# EAGLE schematic EXP (EAGLE 5.11)
BOM: EXCLUDE; PARTNO: CC0402ZRY5V7BB104
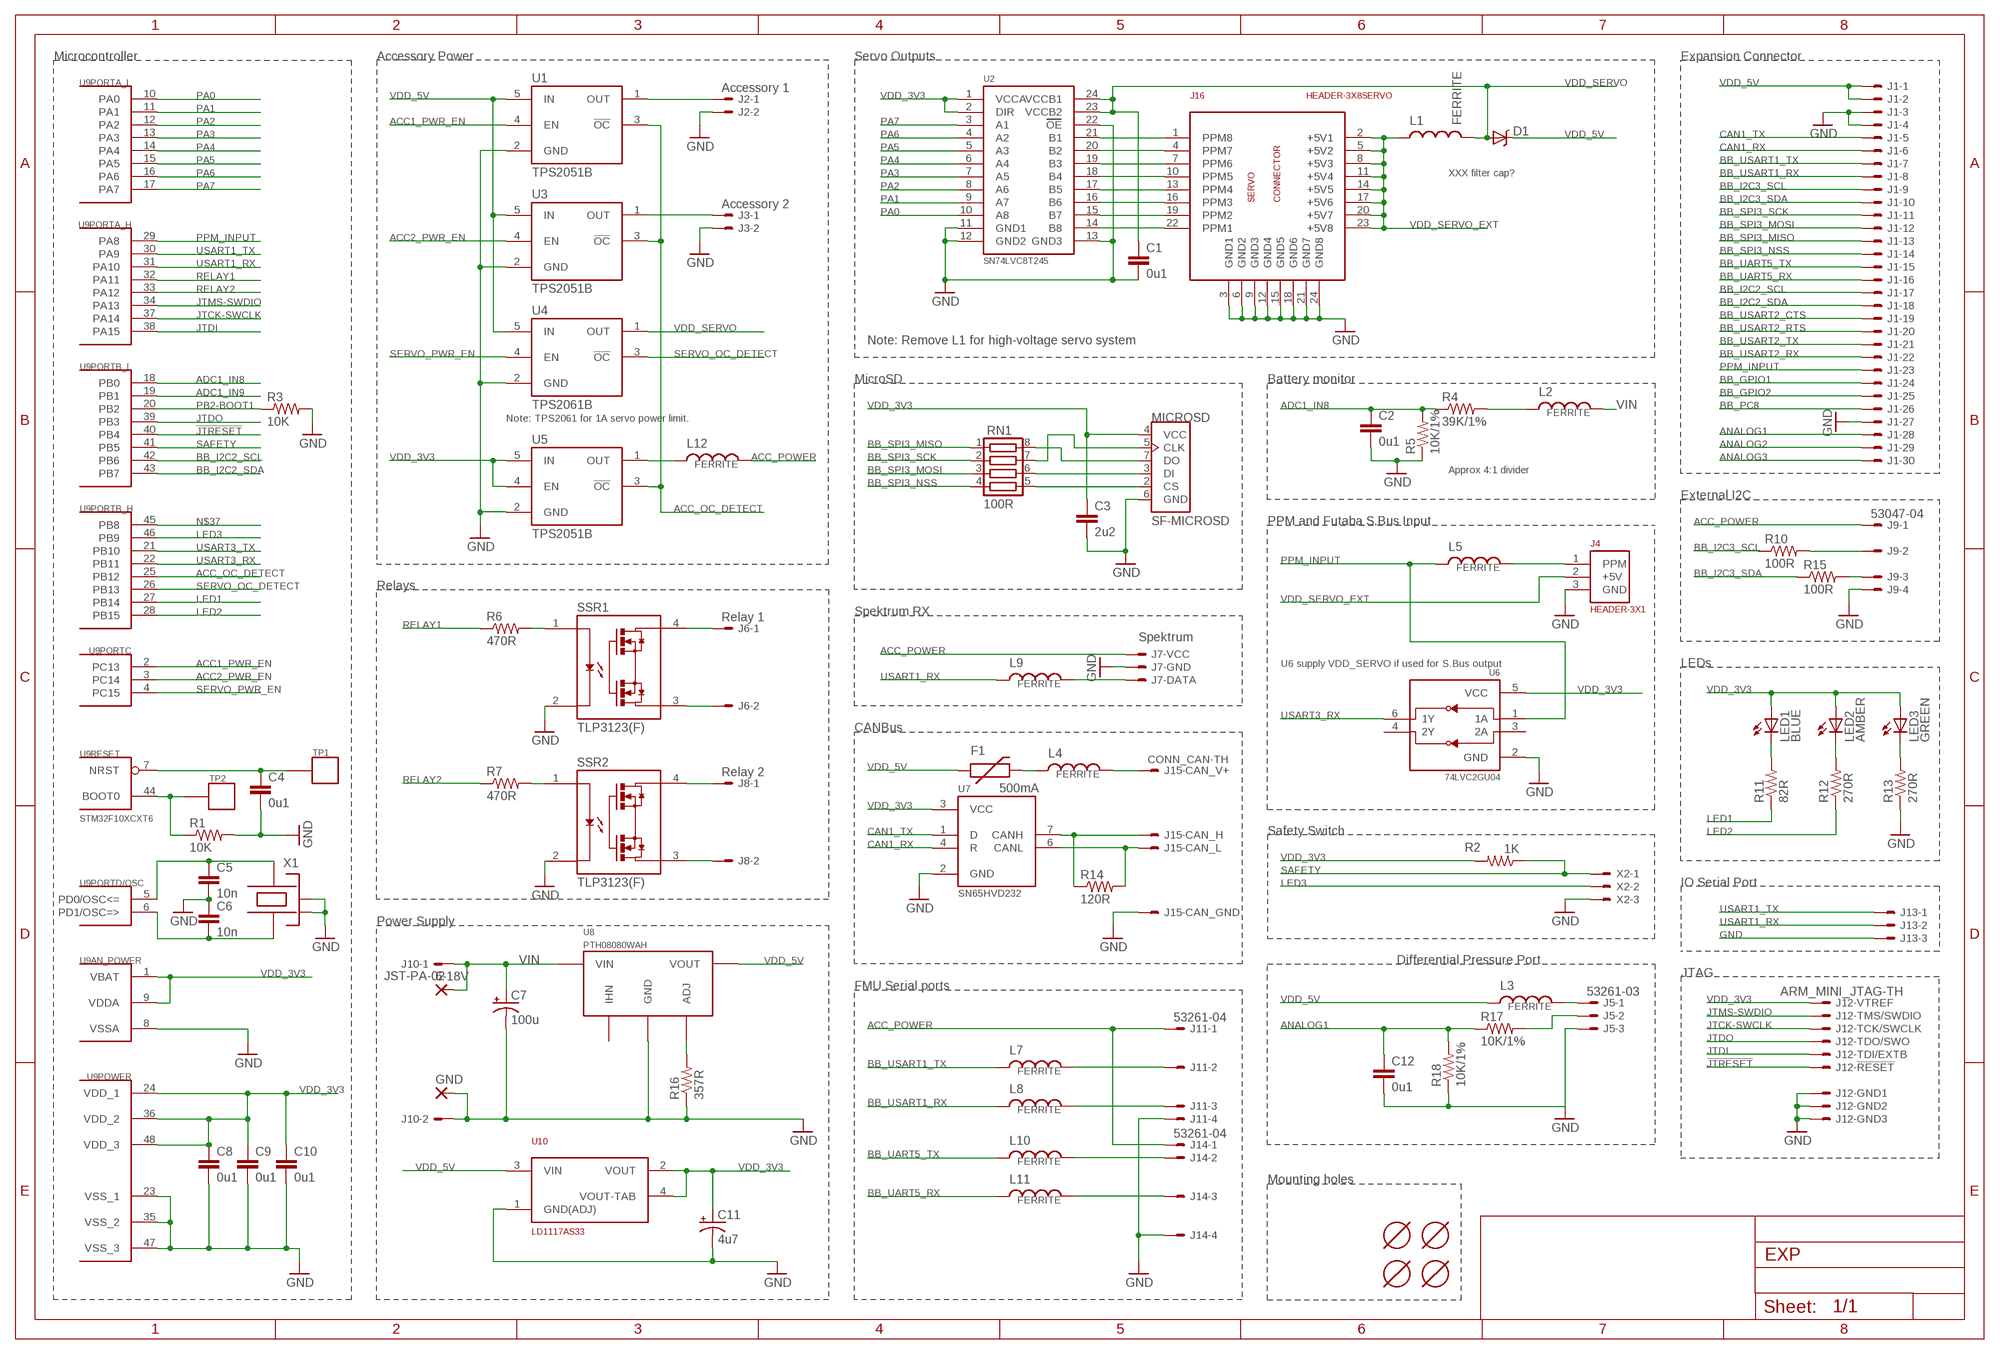
[diagram p0: schematic, sheet 1]

## Parts
6-18V  WIREPADSMD3,5-2  [3,5-2]
C1  0u1  CAP0402-CAP  [0402-CAP]
C2  0u1  CAP0402-CAP  [0402-CAP]
C3  2u2  CAP0402-CAP  [0402-CAP]
C4  0u1  CAP0402-CAP  [0402-CAP]
C5  10n  CAP0402-CAP  [0402-CAP]
C6  10n  CAP0402-CAP  [0402-CAP]
C7  100u  CAP_POL7343  [EIA7343]
C8  0u1  CAP0402-CAP  [0402-CAP]
C9  0u1  CAP0402-CAP  [0402-CAP]
C10  0u1  CAP0402-CAP  [0402-CAP]
C11  4u7  CAP_POL1206  [EIA3216]
C12  0u1  CAP0402-CAP  [0402-CAP]
D1  DIODE-SCHOTTKY_MSMP  [MICROSMP]
F1  500mA  PTC0603  [0603]
GND  WIREPADSMD3,5-2  [3,5-2]
J1  HEADER_2X15-REV  [HEADER_2MM_2X15_REVERSE]
J2  Accessory 1  53047-02  [53047-02]
J3  Accessory 2  53047-02  [53047-02]
J4  HEADER-3X1  [3X1RA]
J5  53261-03  [53261-03]
J6  Relay 1  53047-02  [53047-02]
J7  CONN_SPEKTRUM_RX-TH  [B3B-ZR]
J8  Relay 2  53047-02  [53047-02]
J9  53047-04  [53047-04]
J10  JST-PA-02  [S02B-PASK-2]
J11  53261-04  [53261-04]
J12  ARM_MINI_JTAG-TH  [FTSH-105-01-XXX-DV]
J13  53047-03  [53047-03]
J14  53261-04  [53261-04]
J15  CONN_CAN-TH  [B4B-PH-K-S]
J16  HEADER-3X8SERVO  [3X8RA]
L1  FERRITE  INDUCTOR0402  [0402-IND]
L2  FERRITE  INDUCTOR0402  [0402-IND]
L3  FERRITE  INDUCTOR0402  [0402-IND]
L4  FERRITE  INDUCTOR0402  [0402-IND]
L5  FERRITE  INDUCTOR0402  [0402-IND]
L7  FERRITE  INDUCTOR0402  [0402-IND]
L8  FERRITE  INDUCTOR0402  [0402-IND]
L9  FERRITE  INDUCTOR0402  [0402-IND]
L10  FERRITE  INDUCTOR0402  [0402-IND]
L11  FERRITE  INDUCTOR0402  [0402-IND]
L12  FERRITE  INDUCTOR0402  [0402-IND]
LED1  BLUE  LED0603  [LED-0603]
LED2  AMBER  LED0603  [LED-0603]
LED3  GREEN  LED0603  [LED-0603]
MICROSD  SF-MICROSD  [MICROSD]
R1  10K  RESISTOR0402-RES  [0402-RES]
R2  1K  RESISTOR0402-RES  [0402-RES]
R3  10K  RESISTOR0402-RES  [0402-RES]
R4  39K/1%  RESISTOR0402-RES  [0402-RES]
R5  10K/1%  RESISTOR0402-RES  [0402-RES]
R6  470R  RESISTOR0402-RES  [0402-RES]
R7  470R  RESISTOR0402-RES  [0402-RES]
R10  100R  RESISTOR0402-RES  [0402-RES]
R11  82R  RESISTOR0402-RES  [0402-RES]
R12  270R  RESISTOR0402-RES  [0402-RES]
R13  270R  RESISTOR0402-RES  [0402-RES]
R14  120R  RESISTOR0402-RES  [0402-RES]
R15  100R  RESISTOR0402-RES  [0402-RES]
R16  357R  RESISTOR0402-RES  [0402-RES]
R17  10K/1%  RESISTOR0402-RES  [0402-RES]
R18  10K/1%  RESISTOR0402-RES  [0402-RES]
RN1  100R  CTS742C083  [CTS742C083]
SSR1  TLP3123(F)  TLP3123SO  [SOP4-2.54]
SSR2  TLP3123(F)  TLP3123SO  [SOP4-2.54]
TP1  PAD.03  [PAD.03X.03]
TP2  PAD.03  [PAD.03X.03]
U1  TPS2051B  [SOT23-5L]
U2  SN74LVC8T245  [R-PDSO-G24]
U3  TPS2051B  [SOT23-5L]
U4  TPS2061B  TPS2051B  [SOT23-5L]
U5  TPS2051B  [SOT23-5L]
U6  74LVC2GU04  [SOT363_PHILIPS]
U7  SN65HVD232  [SO08]
U8  PTH08080WAH  [PTH08080W_TH]
U9  STM32F10XCXT6  [TQFP48]
U10  LD1117AS33  [SOT-223]
U$2  MOUNT-HOLE2.1MM  [MOUNT-HOLE2.1]
U$3  MOUNT-HOLE2.1MM  [MOUNT-HOLE2.1]
U$4  MOUNT-HOLE2.1MM  [MOUNT-HOLE2.1]
U$5  MOUNT-HOLE2.1MM  [MOUNT-HOLE2.1]
X1  OSCILLATOR  [OSCILLATOR-5.0X3.2]
X2  53261-03  [53261-03]

## Nets
!JTRESET: J12.10 U9.40(PORTB_L:PB4)
ACC1_PWR_EN: U1.4(EN) U9.2(PORTC:PC13)
ACC2_PWR_EN: U3.4(EN) U9.3(PORTC:PC14)
ACC_OC_DETECT: U1.3(!OC) U3.3(!OC) U5.3(!OC) U9.25(PORTB_H:PB12)
ACC_POWER [power]: J7.3 J9.1 J11.1 J14.1 L12.2
ADC1_IN8: C2.1 R4.1 R5.2 U9.18(PORTB_L:PB0)
ADC1_IN9: U9.19(PORTB_L:PB1)
ANALOG1: C12.1 J1.28 R17.1 R18.2
ANALOG2: J1.29
ANALOG3: J1.30
BB_GPIO1: J1.24
BB_GPIO2: J1.25
BB_I2C2_SCL: J1.17 U9.42(PORTB_L:PB6)
BB_I2C2_SDA: J1.18 U9.43(PORTB_L:PB7)
BB_I2C3_SCL: J1.9 R10.1
BB_I2C3_SDA: J1.10 R15.1
BB_PC8: J1.26
BB_SPI3_MISO: J1.13 RN1.1
BB_SPI3_MOSI: J1.12 RN1.3
BB_SPI3_NSS: J1.14 RN1.4
BB_SPI3_SCK: J1.11 RN1.2
BB_UART5_RX: J1.16 L11.1
BB_UART5_TX: J1.15 L10.1
BB_USART1_RX: J1.8 L8.1
BB_USART1_TX: J1.7 L7.1
BB_USART2_CTS: J1.19
BB_USART2_RTS: J1.20
BB_USART2_RX: J1.22
BB_USART2_TX: J1.21
BOOT0: R1.1 TP2.P$1 U9.44(RESET:BOOT0)
CAN1_RX: J1.6 U7.4(R)
CAN1_TX: J1.5 U7.1(D)
GND [power]: C1.2 C2.2 C3.2 C4.2 C5.2 C6.1 C7.C(-) C8.2 C9.2 C10.2 C11.C(-) C12.2 GND.1(P) J1.3 J1.4 J1.27 J2.2 J3.2 J4.3(GND) J5.3 J7.2 J9.4 J10.2 J11.4 J12.3 J12.5 J12.9 J13.3 J14.4 J15.4 J16.3(GND1) J16.6(GND2) J16.9(GND3) J16.12(GND4) J16.15(GND5) J16.18(GND6) J16.21(GND7) J16.24(GND8) MICROSD.6(GND) R1.2 R3.2 R5.1 R13.1 R16.1 R18.1 SSR1.2 SSR2.2 U1.2(GND) U2.11(GND1) U2.12(GND2) U2.13(GND3) U2.22(OE) U3.2(GND) U4.2(GND) U5.2(GND) U6.2(GND) U7.2(GND) U8.2(GND) U9.8(AN_POWER:VSSA) U9.23(POWER:VSS_1) U9.35(POWER:VSS_2) U9.47(POWER:VSS_3) U10.1(GND(ADJ)) X1.2(NC_2) X1.4(NC_4) X2.3
J6-DATA: J7.1 L9.2
JTCK-SWCLK: J12.4 U9.37(PORTA_H:PA14)
JTDI: J12.8 U9.38(PORTA_H:PA15)
JTDO: J12.6 U9.39(PORTB_L:PB3)
JTMS-SWDIO: J12.2 U9.34(PORTA_H:PA13)
LED1: R11.1 U9.27(PORTB_H:PB14)
LED2: R12.1 U9.28(PORTB_H:PB15)
LED3: U9.46(PORTB_H:PB9) X2.2
N$1: R7.2 SSR2.1
N$2: R6.2 SSR1.1
N$3: MICROSD.7(DO) RN1.8
N$4 [power]: L12.1 U5.1(OUT)
N$5: C6.2 U9.6(PORTD/OSC:PD1/OSC=>) X1.1
N$6: C5.1 U9.5(PORTD/OSC:PD0/OSC<=) X1.3
N$7: L2.1 R4.2
N$8: LED1.C R11.2
N$9: R16.2 U8.4(ADJ)
N$10: J4.1(PPM) L5.2
N$11: MICROSD.5(CLK) RN1.7
N$12: MICROSD.3(DI) RN1.6
N$13: MICROSD.2(CS) RN1.5
N$14: F1.2 L4.1
N$15: J5.2 R17.2
N$19: J14.3 L11.2
N$21 [power]: J8.1 SSR2.4
N$22 [power]: J8.2 SSR2.3
N$23 [power]: J6.2 SSR1.3
N$24 [power]: J6.1 SSR1.4
N$25: J14.2 L10.2
N$26: J11.3 L8.2
N$27: J9.3 R15.2
N$28: J9.2 R10.2
N$29 [power]: J2.1 U1.1(OUT)
N$30 [power]: J3.1 U3.1(OUT)
N$31: LED2.C R12.2
N$37: U9.45(PORTB_H:PB8)
N$38: LED3.C R13.2
N$41: J11.2 L7.2
N$43: J15.2 R14.1 U7.7(CANH)
N$44: J15.3 R14.2 U7.6(CANL)
N$47 [power]: J15.1 L4.2
NRST: C4.1 TP1.P$1 U9.7(RESET:NRST)
PA0: U2.10(A8) U9.10(PORTA_L:PA0)
PA1: U2.9(A7) U9.11(PORTA_L:PA1)
PA2: U2.8(A6) U9.12(PORTA_L:PA2)
PA3: U2.7(A5) U9.13(PORTA_L:PA3)
PA4: U2.6(A4) U9.14(PORTA_L:PA4)
PA5: U2.5(A3) U9.15(PORTA_L:PA5)
PA6: U2.4(A2) U9.16(PORTA_L:PA6)
PA7: U2.3(A1) U9.17(PORTA_L:PA7)
PB2-BOOT1: R3.1 U9.20(PORTB_L:PB2)
PPM1: J16.22(PPM1) U2.14(B8)
PPM2: J16.19(PPM2) U2.15(B7)
PPM3: J16.16(PPM3) U2.16(B6)
PPM4: J16.13(PPM4) U2.17(B5)
PPM5: J16.10(PPM5) U2.18(B4)
PPM6: J16.7(PPM6) U2.19(B3)
PPM7: J16.4(PPM7) U2.20(B2)
PPM8: J16.1(PPM8) U2.21(B1)
PPM_INPUT: J1.23 L5.1 U6.1(1A) U9.29(PORTA_H:PA8)
RELAY1: R6.1 U9.32(PORTA_H:PA11)
RELAY2: R7.1 U9.33(PORTA_H:PA12)
SAFETY: R2.1 U9.41(PORTB_L:PB5) X2.1
SERVO_OC_DETECT: U4.3(!OC) U9.26(PORTB_H:PB13)
SERVO_PWR_EN: U4.4(EN) U9.4(PORTC:PC15)
USART1_RX: J13.2 L9.1 U9.31(PORTA_H:PA10)
USART1_TX: J13.1 U9.30(PORTA_H:PA9)
USART3_RX: U6.6(1Y) U9.22(PORTB_H:PB11)
USART3_TX: U9.21(PORTB_H:PB10)
VDD_3V3 [power]: C3.1 C8.1 C9.1 C10.1 C11.A(+) J12.1 LED1.A LED2.A LED3.A MICROSD.4(VCC) R2.2 U2.1(VCCA) U2.2(DIR) U5.4(EN) U5.5(IN) U6.5(VCC) U7.3(VCC) U9.1(AN_POWER:VBAT) U9.9(AN_POWER:VDDA) U9.24(POWER:VDD_1) U9.36(POWER:VDD_2) U9.48(POWER:VDD_3) U10.2(VOUT) U10.4(VOUT-TAB)
VDD_5V [power]: D1.CATHODE(C) F1.1 J1.1 J1.2 L3.1 U1.5(IN) U3.5(IN) U4.5(IN) U8.3(VOUT) U10.3(VIN)
VDD_5V_ANALOG [power]: J5.1 L3.2
VDD_SERVO [power]: C1.1 D1.ANODE(A) L1.2 U2.23(VCCB2) U2.24(VCCB1) U4.1(OUT)
VDD_SERVO_EXT [power]: J4.2(+5V) J16.2(+5V1) J16.5(+5V2) J16.8(+5V3) J16.11(+5V4) J16.14(+5V5) J16.17(+5V6) J16.20(+5V7) J16.23(+5V8) L1.1
VIN [power]: 6-18V.1(P) C7.A(+) J10.1 L2.2 U8.1(VIN)
Unconnected: U6.3(2A) U6.4(2Y) U7.5(NC) U7.8(NC2) U8.5(IHN)

## Notes on the sheet
- Microcontroller | Accessory Power | Servo Outputs | Expansion Connector
- XXX filter cap?
- Note: Remove L1 for high-voltage servo system
- MicroSD | Battery monitor
- Note: TPS2061 for 1A servo power limit.
- Approx 4:1 divider
- External I2C
- PPM and Futaba S.Bus Input
- Relays
- Spektrum RX
- Spektrum
- U6 supply VDD_SERVO if used for S.Bus output | LEDs
- CANBus
- Safety Switch
- IO Serial Port
- Power Supply
- Differential Pressure Port
- JTAG
- FMU Serial ports
- Mounting holes

## Library data of the parts
6-18V GND = pixhawk2:WIREPAD: Wire PAD connect wire on PCB
C1-C6 C8-C10 C12 = pixhawk2:CAP: Capacitor Standard 0603 ceramic capacitor, and 0.1" leaded capacitor.
C7 C11 = pixhawk2:CAP_POL: Capacitor Polarized These are standard SMD and PTH capacitors. Normally 10uF, 47uF, and 100uF in electrolytic and tantalum varieties. Always verify the external diameter of the through hole cap, it varies with capacity, voltage, and manufacturer. The EIA devices should be standard.
D1 = pixhawk2:DIODE-SCHOTTKY: Schottky barrier diode in DO214AC, e.g. Fairchild SS14.
F1 = pixhawk2:PTC: Resettable Fuse PTC Resettable Fuse. Spark Fun Electronics SKU : COM-08357
J1 = pixhawk2:HEADER_2X15: 2X15 header
J2 J3 J6 J8 = pixhawk2:53?-02: CONNECTOR wire to board 1.25 mm (.049 inch) pitch header
J4 = pixhawk2:HEADER-3X1
J5 J13 X2 = pixhawk2:53?-03: CONNECTOR wire to board 1.25 mm (.049 inch) pitch header
J7 = pixhawk2:CONN_SPEKTRUM_RX: Spektrum RX connector; JST ZH series S3B-ZR-SM4A-TF
J9 J11 J14 = pixhawk2:53?-04: CONNECTOR wire to board 1.25 mm (.049 inch) pitch header
J10 = pixhawk2:JST-PA-02: JST PA Series http://www.jst-mfg.com/product/pdf/eng/ePA-F.pdf
J12 = pixhawk2:ARM_MINI_JTAG: CONNECTOR wire to board 1.25 mm (.049 inch) pitch header
J15 = pixhawk2:CONN_CAN
J16 = pixhawk2:HEADER-3X8
L1-L5 L7-L12 = pixhawk2:INDUCTOR: Inductors Basic Inductor/Choke - 0603 and 1206. Footprints are not proven and vary greatly between part numbers.
LED1-LED3 = pixhawk2:LED: LEDs Standard schematic elements and footprints for 5mm, 3mm, 1206, and 0603 sized LEDs. 5mm - Spark Fun Electronics SKU : COM-00529 (and others)
MICROSD = pixhawk2:SF-MICROSD
R1-R7 R10-R18 = pixhawk2:RESISTOR: Resistor Basic schematic elements and footprints for 0603, 1206, and PTH 1/10th watt (small) resistors.
RN1 = pixhawk2:CTS742C083: Chip Resistor Array 4 Single Resistor Source: http://www.ctscorp.com/components/Datasheets/CTSChipArrayDs.pdf; OC_FARNELL: unknown; OC_NEWARK: unknown
SSR1 SSR2 = pixhawk2:TLP3123: TLP3123 Solid State Relay The TOSHIBA TLP3123 consists of a gallium arsenide infrared emitting diode optically coupled to a photo-MOS FET in a plastic SOP package. The TLP3123 is a bi-directional switch, which can replace mechanical relays in many applications. And its high on-state current maximum rating and low on-state resistance is suitable to control a power line. http://www.semicon.toshiba.co.jp/docs/datasheet/en/Opto/TLP3123_en_datasheet_071001.pdf
TP1 TP2 = pixhawk2:PAD
U1 U3-U5 = pixhawk2:TPS2051B: CURRENT-LIMITED, POWER-DISTRIBUTION SWITCH The TPS204xB/TPS205xB power-distribution switches are intended for applications where heavy capacitive loads and short circuits are likely to be encountered. 500-mA continuous current, accurate Current Limit (0.75 A min, 1.25 A max), operating range: 2.7 V to 5.5 V. These devices incorporates 70-m? N-channel MOSFET power switches for power-distribution systems that require multiple power switches in a single package. Each switch is controlled by a logic enable input. Gate drive is provided by an internal charge pump designed to control the power-switch rise times and fall times to minimize current surges during switching. The charge pump requires no external components and allows operation from supplies as low as 2.7 V. http://focus.ti.com/lit/ds/symlink/tps2051b.pdf
U2 = pixhawk2:SN74LVC8T245
U6 = pixhawk2:74LVC2GU04: DUAL INVERTER GATE This dual inverter is designed for 1.65-V to 5.5-V VCC operation. The SN74LVC2GU04 contains two inverters with unbuffered outputs and performs the Boolean function Y = A. It is available from NXP and TI. http://www.nxp.com/documents/data_sheet/74LVC2GU04.pdf http://focus.ti.com/lit/ds/symlink/sn74lvc2gu04.pdf
U7 = pixhawk2:SN65HVD232: 3.3-V CAN TRANSCEIVER
U8 = pixhawk2:PTH08080W: 2.25-A, WIDE-INPUT ADJUSTABLE SWITCHING REGULATOR The input voltage range of the PTH08080W is from 4.5 V to 18 V, allowing operation from either a 5-V or 12-V input bus. Using state-of-the-art switched-mode power-conversion technology, the PTH08080W can step down to voltages as low as 0.9 V from a 5-V input bus, with less than 1 W of power dissipation. The output voltage can be adjusted to any voltage over the range, 0.9 V to 5.5 V, using a single external resistor. Operating features include an undervoltage lockout (UVLO), on/off inhibit, overcurrent protection, and overtemperature protection. http://focus.ti.com/lit/ds/symlink/pth08080w.pdf
U9 = pixhawk2:STM32F10XCXT6: ST STM32F101/103 48pin LQFP
U10 = pixhawk2:LD1117A: LD1117A LDO Datasheet: http://www.st.com/stonline/books/pdf/docs/7194.pdf
U$2-U$5 = pixhawk2:MOUNT-HOLE
X1 = pixhawk2:OSCILLATOR: Crystal Oscillator in 3.2x2.5 SMD

## Net classes
0 default: width 0.203 mm, clearance 0.203 mm
1 power: width 0.254 mm, drill 0.3 mm, clearance 0.203 mm